# EAGLE design devkit (EAGLE 7.5.0)

## Sheet 1 of 3
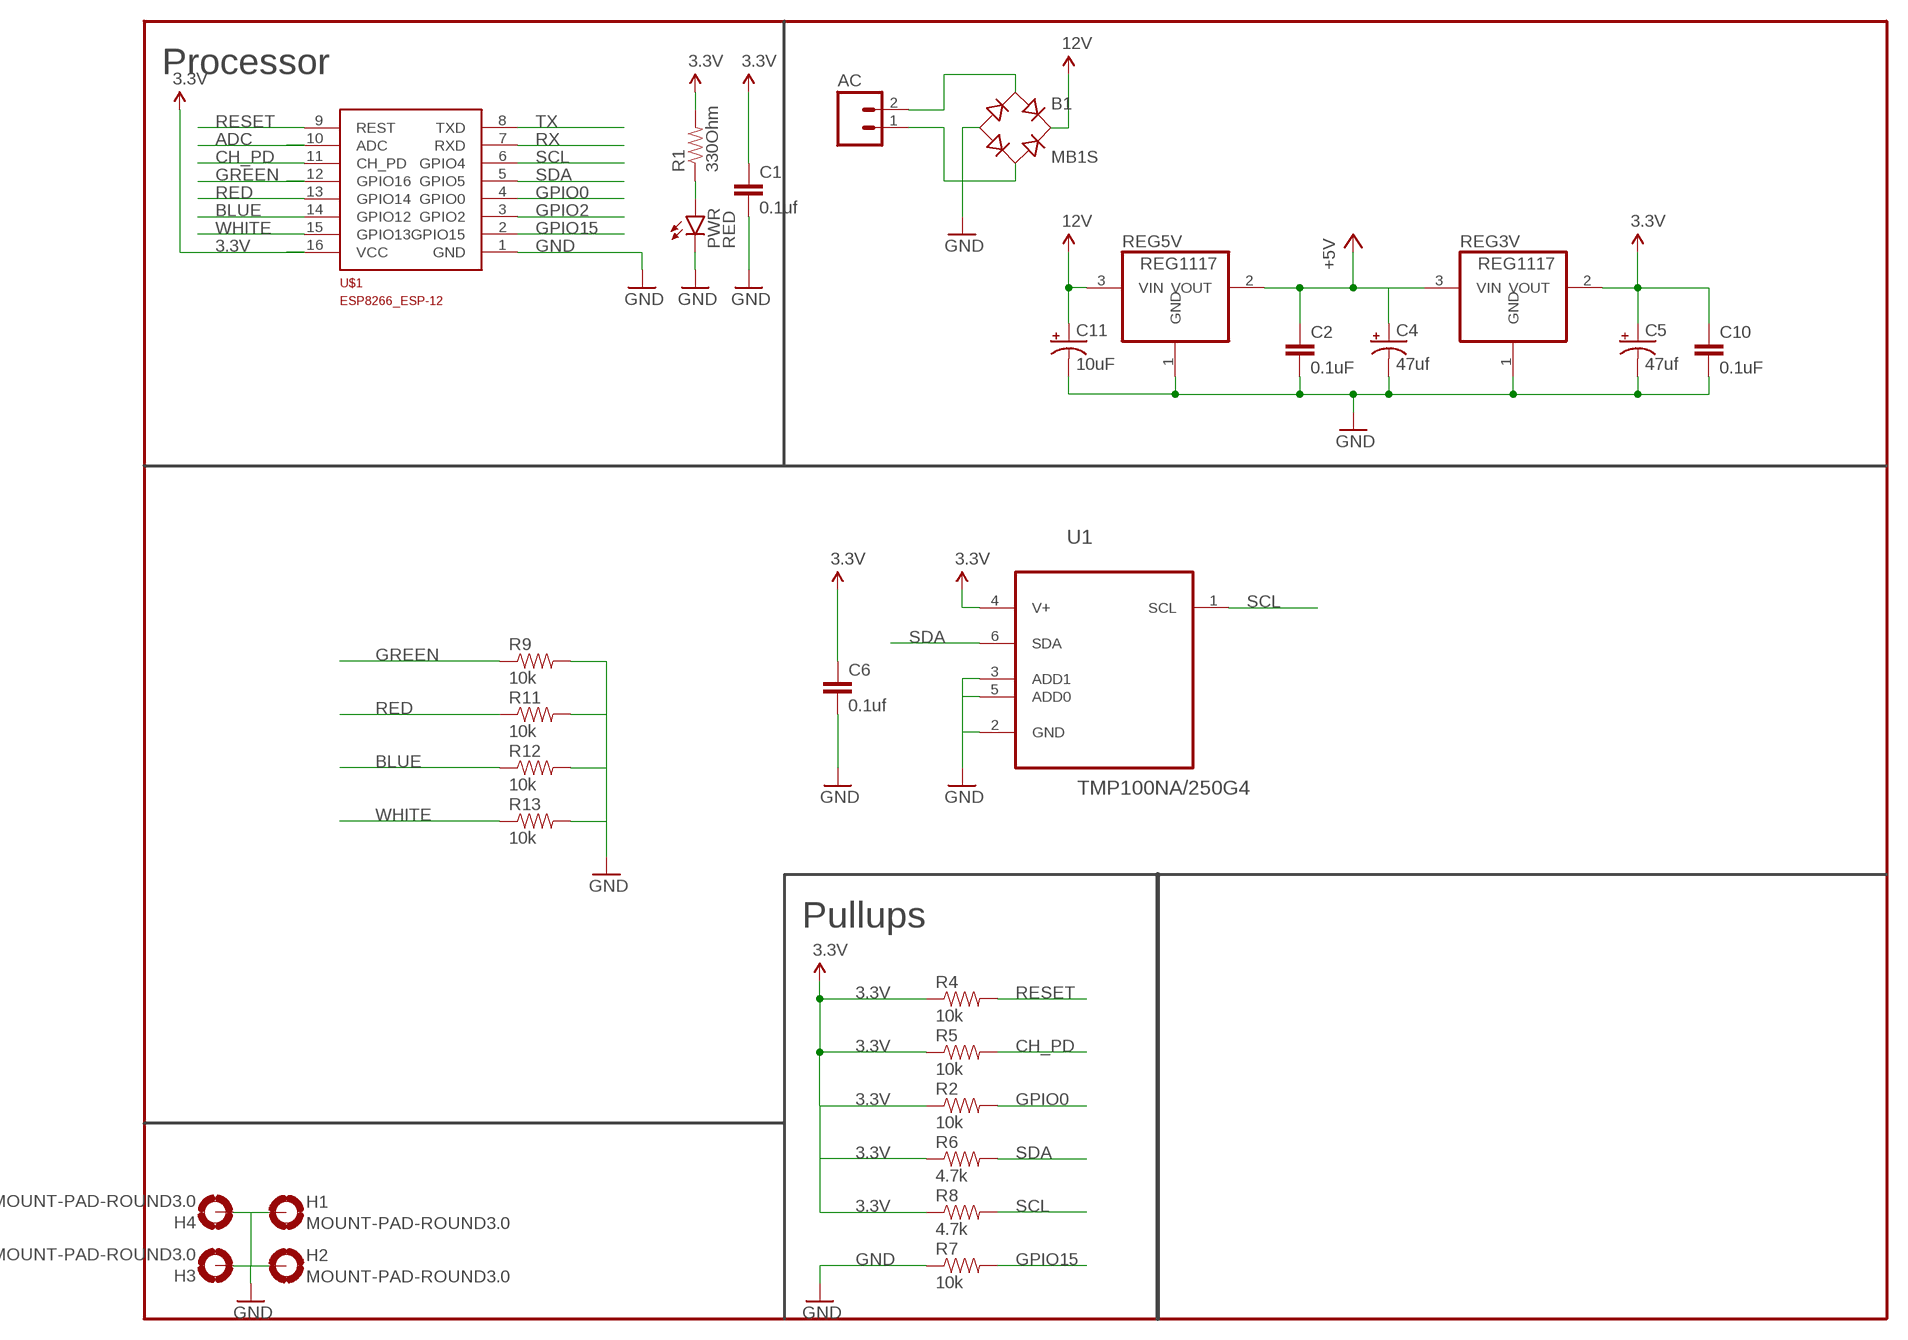
[diagram p0: schematic, sheet 1]

### Parts
AC  M02JST-PTH-VERT  [JST-2-PTH-VERT]
B1  MB1S  [SOIC-4]
C1  0.1uf  CAP0805  [0805]
C2  0.1uF  CAP0805  [0805]
C4  47uf  CAP_POLC  [PANASONIC_C]
C5  47uf  CAP_POLC  [PANASONIC_C]
C6  0.1uf  CAP0805  [0805]
C10  0.1uF  CAP0805  [0805]
C11  10uF  10UF-TANT  [EIA3216]
FRAME1  FRAME-LETTERNO_PACKAGE  [DUMMY]
H1  MOUNT-PAD-ROUND3.0  [3,0-PAD]
H2  MOUNT-PAD-ROUND3.0  [3,0-PAD]
H3  MOUNT-PAD-ROUND3.0  [3,0-PAD]
H4  MOUNT-PAD-ROUND3.0  [3,0-PAD]
PWR  RED  LED-RED1206  [LED-1206]
R1  330Ohm  RESISTOR0805-RES  [0805]
R2  10k  RESISTOR0805-RES  [0805]
R4  10k  RESISTOR0805-RES  [0805]
R5  10k  RESISTOR0805-RES  [0805]
R6  4.7k  RESISTOR0805-RES  [0805]
R7  10k  RESISTOR0805-RES  [0805]
R8  4.7k  RESISTOR0805-RES  [0805]
R9  10k  RESISTOR0805-RES  [0805]
R11  10k  RESISTOR0805-RES  [0805]
R12  10k  RESISTOR0805-RES  [0805]
R13  10k  RESISTOR0805-RES  [0805]
REG3V  REG1117  [SOT223]
REG5V  REG1117  [SOT223]
U1  TMP100NA/250G4  [SOT95P280X145-6N]
U$1  ESP8266_ESP-12  [ESP8266-ESP12]

### Nets
3.3V: C1.1 C5.+ C6.1 C10.1 R1.2 R2.1 R4.1 R5.1 R6.1 R8.1 REG3V.2(VOUT) U1.4(V+) U$1.16(VCC) ; also sheet 2
12V: B1.+ C11.A(+) REG5V.3(VIN) ; also sheet 3
+5V: C2.1 C4.+ REG3V.3(VIN) REG5V.2(VOUT) ; also sheet 2
ADC: U$1.10(ADC)
BLUE: R12.1 U$1.14(GPIO12) ; also sheet 3
CH_PD: R5.2 U$1.11(CH_PD)
GND: B1.- C1.2 C2.2 C4.- C5.- C6.2 C10.2 C11.C(-) H1.B3,0(MOUNT) H2.B3,0(MOUNT) H3.B3,0(MOUNT) H4.B3,0(MOUNT) PWR.C R7.1 R9.2 R11.2 R12.2 R13.2 REG3V.1(GND) REG5V.1(GND) U1.2(GND) U1.3(ADD1) U1.5(ADD0) U$1.1(GND) ; also sheet 2,3
GPIO0: R2.2 U$1.4(GPIO0) ; also sheet 2
GPIO2: U$1.3(GPIO2)
GPIO15: R7.2 U$1.2(GPIO15)
GREEN: R9.1 U$1.12(GPIO16) ; also sheet 3
N$2: PWR.A R1.1
N$3: AC.2 B1.~1(AC1)
N$4: AC.1 B1.~2(AC2)
RED: R11.1 U$1.13(GPIO14) ; also sheet 3
RESET: R4.2 U$1.9(REST) ; also sheet 2
RX: U$1.7(RXD) ; also sheet 2
SCL: R8.2 U1.1(SCL) U$1.6(GPIO4)
SDA: R6.2 U1.6(SDA) U$1.5(GPIO5)
TX: U$1.8(TXD) ; also sheet 2
WHITE: R13.1 U$1.15(GPIO13) ; also sheet 3

### Notes on the sheet
- Processor
- Pullups

## Sheet 2 of 3
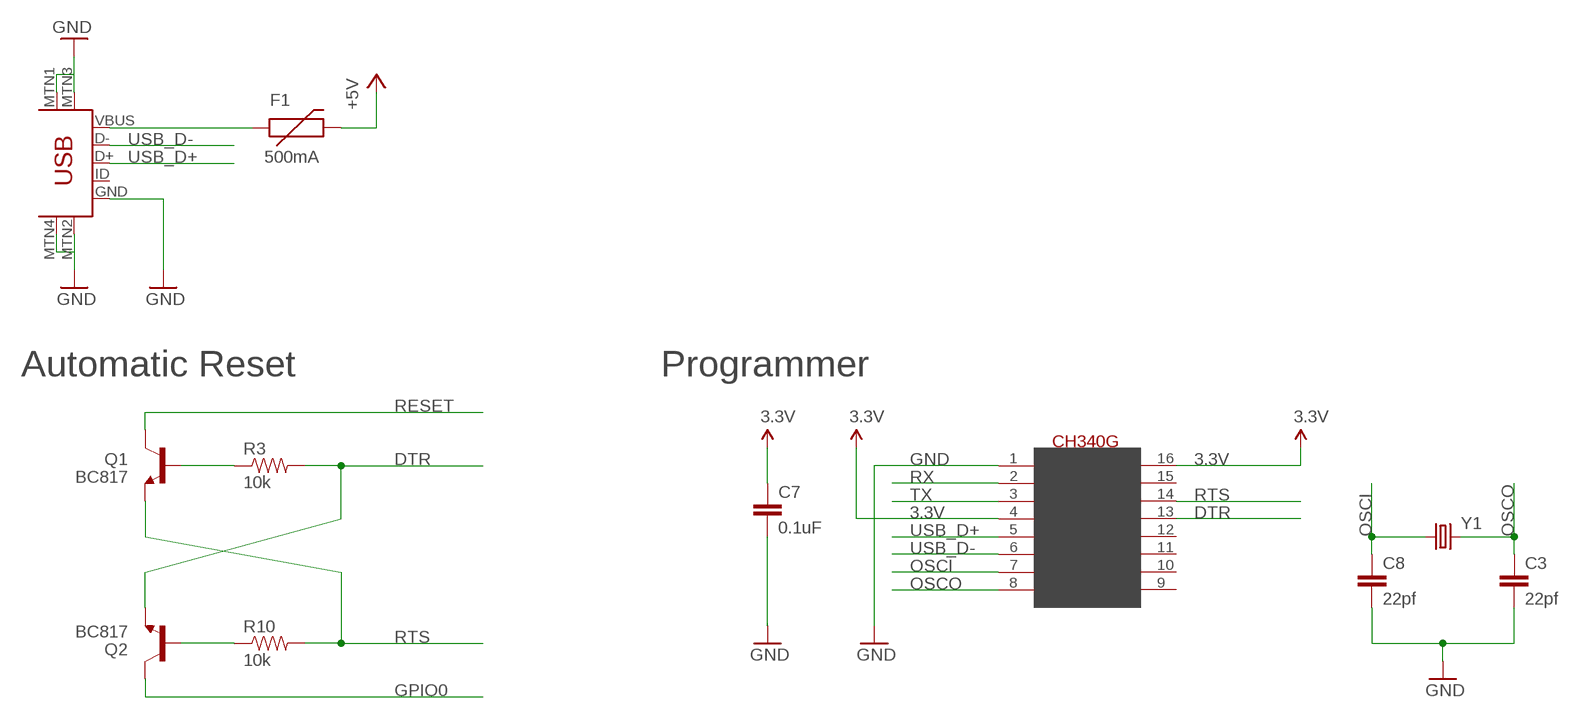
[diagram p1: schematic, sheet 2]

### Parts
C3  22pf  CAP0805  [0805]
C7  0.1uF  CAP0805  [0805]
C8  22pf  CAP0805  [0805]
F1  500mA  PTCSMD-W  [PTC-1206-WIDE]
Q1  BC817  TRANSISTOR_NPNSOT23-3  [SOT23-3]
Q2  BC817  TRANSISTOR_NPNSOT23-3  [SOT23-3]
R3  10k  RESISTOR0805-RES  [0805]
R10  10k  RESISTOR0805-RES  [0805]
U$2  CH340G  [SOIC16]
U$3  USB-MINIB-5PIN  [USB-MINIB]
Y1  CRYSTALSMD  [HC49UP]

### Nets
3.3V: C7.1 U$2.4(V3) U$2.16(VCC) ; also sheet 1
+5V: F1.2 ; also sheet 1
DTR: Q2.2(E) R3.2 U$2.13(DTR)
GND: C3.2 C7.2 C8.2 U$2.1(GND) U$3.GND U$3.MTN1(MTN2) U$3.MTN2(MTN3) U$3.MTN3(MTN1) U$3.MTN4 ; also sheet 1,3
GPIO0: Q2.3(C) ; also sheet 1
N$1: Q1.1(B) R3.1
N$5: Q2.1(B) R10.1
N$6: F1.1 U$3.VBUS
OSCI: C8.1 U$2.7(XI) Y1.1
OSCO: C3.1 U$2.8(XO) Y1.2
RESET: Q1.3(C) ; also sheet 1
RTS: Q1.2(E) R10.2 U$2.14(RTS)
RX: U$2.2(TX) ; also sheet 1
TX: U$2.3(RX) ; also sheet 1
USB_D+: U$2.5(D+) U$3.D+
USB_D-: U$2.6(D-) U$3.D-
Unconnected: U$2.9(CTS) U$2.10(DSR) U$2.11(RI) U$2.12(DCD) U$2.15(RS232) U$3.ID

### Notes on the sheet
- Automatic Reset | Programmer

## Sheet 3 of 3
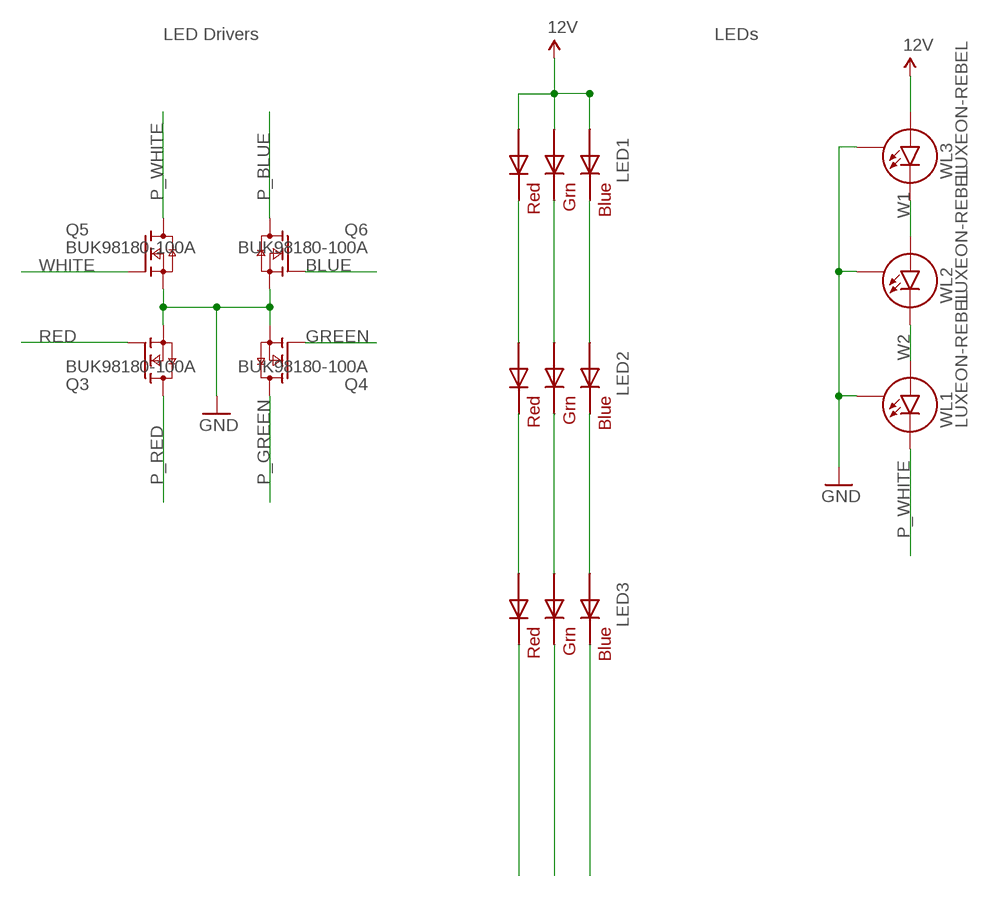
[diagram p2: schematic, sheet 3]

### Parts
LED1  RGBLED5050  [RGBLED5050]
LED2  RGBLED5050  [RGBLED5050]
LED3  RGBLED5050  [RGBLED5050]
Q3  BUK98180-100A  [SOT223]
Q4  BUK98180-100A  [SOT223]
Q5  BUK98180-100A  [SOT223]
Q6  BUK98180-100A  [SOT223]
WL1  LUXEON-REBEL  [LUXEON-REBEL]
WL2  LUXEON-REBEL  [LUXEON-REBEL]
WL3  LUXEON-REBEL  [LUXEON-REBEL]

### Nets
12V: LED1.1(GREEN_A) LED1.2(RED_A) LED1.3(BLUE_A) WL3.ANODE(A) ; also sheet 1
BLUE: Q6.1(G) ; also sheet 1
GND: Q3.3(S) Q4.3(S) Q5.3(S) Q6.3(S) WL1.P$3(S) WL2.P$3(S) WL3.P$3(S) ; also sheet 1,2
GREEN: Q4.1(G) ; also sheet 1
N$7: LED1.6(GREEN_C) LED2.1(GREEN_A)
N$8: LED1.4(BLUE_C) LED2.3(BLUE_A)
N$9: LED1.5(RED_C) LED2.2(RED_A)
N$10: LED2.6(GREEN_C) LED3.1(GREEN_A)
N$11: LED2.4(BLUE_C) LED3.3(BLUE_A)
N$12: LED2.5(RED_C) LED3.2(RED_A)
P_BLUE: LED3.4(BLUE_C) Q6.2(D) Q6.4(D)
P_GREEN: LED3.6(GREEN_C) Q4.2(D) Q4.4(D)
P_RED: LED3.5(RED_C) Q3.2(D) Q3.4(D)
P_WHITE: Q5.2(D) Q5.4(D) WL1.CATHODE(C)
RED: Q3.1(G) ; also sheet 1
W1: WL2.ANODE(A) WL3.CATHODE(C)
W2: WL1.ANODE(A) WL2.CATHODE(C)
WHITE: Q5.1(G) ; also sheet 1

### Notes on the sheet
- LED Drivers | LEDs

## Library data of the parts
AC = SparkFun-Connectors:M02: Standard 2-pin 0.1" header. Use with - straight break away headers ( PRT-00116) - right angle break away headers (PRT-00553) - swiss pins (PRT-00743) - machine pins (PRT-00117) - female headers (PRT-00115) Molex polarized connector foot print use with: PRT-08233 with associated crimp pins and housings. 2.54_SCREWTERM for use with PRT-10571. 3.5mm Screw Terminal footprints for PRT-08084 5mm Screw Terminal footprints for use with PRT-08432
B1 = rectifier:MB*S: Bridge Rectifier Source: http://www.fairchildsemi.com/ds/MB/MB6S.pdf
C1-C3 C6-C8 C10 = SparkFun-Capacitors:CAP: Capacitor Standard 0603 ceramic capacitor, and 0.1" leaded capacitor.
C4 C5 = SparkFun-Capacitors:CAP_POL: Capacitor Polarized These are standard SMD and PTH capacitors. Normally 10uF, 47uF, and 100uF in electrolytic and tantalum varieties. Always verify the external diameter of the through hole cap, it varies with capacity, voltage, and manufacturer. The EIA devices should be standard.
C11 = SparkFun-Retired:10UF-TANT: 10uF Tantalum SMT CAP-00811- 16V 10% (EIA-3216); PROD_ID: CAP-00811
F1 = SparkFun-PowerIC:PTC: Resettable Fuse PTC Resettable Fuse. Spark Fun Electronics SKU : COM-08357
FRAME1 = SparkFun-Aesthetics:FRAME-LETTER: Schematic Frame Standard 8.5x11 US Letter frame; DESIGNER: Nobody; VERSION: v01
H1-H4 = holes:MOUNT-PAD-ROUND: MOUNTING PAD, round
LED1-LED3 = adafruit:RGBLED: For 5050 RGB LEDs, the order of the LEDs may vary from one manufacturer to another!
PWR = SparkFun-LED:LED-RED: Assorted Red LEDs LilyPad 1206- DIO-09912 1206- DIO-00809 0603- DIO-00819; PROD_ID: DIO-00809
Q1 Q2 = SparkFun-DiscreteSemi:TRANSISTOR_NPN: Generic NPN BJT MMBT2222A - TRANS-08049 (SOT-23, 1A 40V) MPSA42 - TRANS-09116 (SOT-23, 500mA 300V) MMBT5088LT1G - TRANS-11160 (SOT-23, 50 mA 30V) BC547 - COM-08928 <http://www.sparkfun.com/products/8928> (TO-92 45V 100mA) (1.Collector 2.Base 3.Emitter) 2N3904 - COM-00521 <http://www.sparkfun.com/products/521> (TO-92 40V 200mA) (1.Emitter 2.Base 3.Collector) P2N2222A - COM-12852 <http://www.sparkfun.com/products/12852> (TO-92 40V 600mA) (1.Collector 2.Base 3.Emitter); PROD_ID: TRANS-08049
Q3-Q6 = nxp_60:BUK98180-100A: N-channel TrenchMOS logic level FET Logic level N-channel enhancement mode Field-Effect Transistor (FET) in a plastic package using TrenchMOS technology. This product has been designed and qualified to the appropriate AEC standard for use in automotive critical applications. AAL Eindhoven MK
R1-R13 = SparkFun-Resistors:RESISTOR: Resistor Basic schematic elements and footprints for 0603, 1206, and PTH resistors.
REG3V REG5V = burr-brown:REG1117: 800mA and 1A Low Dropout (LDO) Positive Regulator 1.8V, 2.5V, 2.85V, 3.3V, 5V, and Adj; MPN: REG1117; OC_FARNELL: 1097566; OC_NEWARK: 14P6981
U1 = Texas Instruments_By_element14_Batch_1:TMP100NA/250G4: Digital Temperature Sensor with I2C Interface; MPN: TMP100NA/250G4; OC_FARNELL: 1234659; OC_NEWARK: 13M3229; PACKAGE: SOT-23-6; SUPPLIER: Texas Instruments
U$1 = ESP8266-ESP12:ESP8266_ESP-12
U$2 = CH340G-USB-SERIAL:CH340G
U$3 = SparkFun-Connectors:USB-MINIB: Mini-USB "B" connector with 5th pin broken out. Created new symbol breaking out 5th "ID" pin in mini/micro USB connector spec. See: http://en.wikipedia.org/wiki/Mini_usb#Cables. Uses same footprint as 4-pin symbol. Also added pins to connect to mounting / shield pads if required (probably not generally needed as signals aren't shielded once they leave the connector).
WL1-WL3 = SparkFun-LED:LUXEON-REBEL: Luxeon Rebel single-color high output LED
Y1 = SparkFun-FreqCtrl:CRYSTAL: Various standard crystals. Proven footprints.

## Board
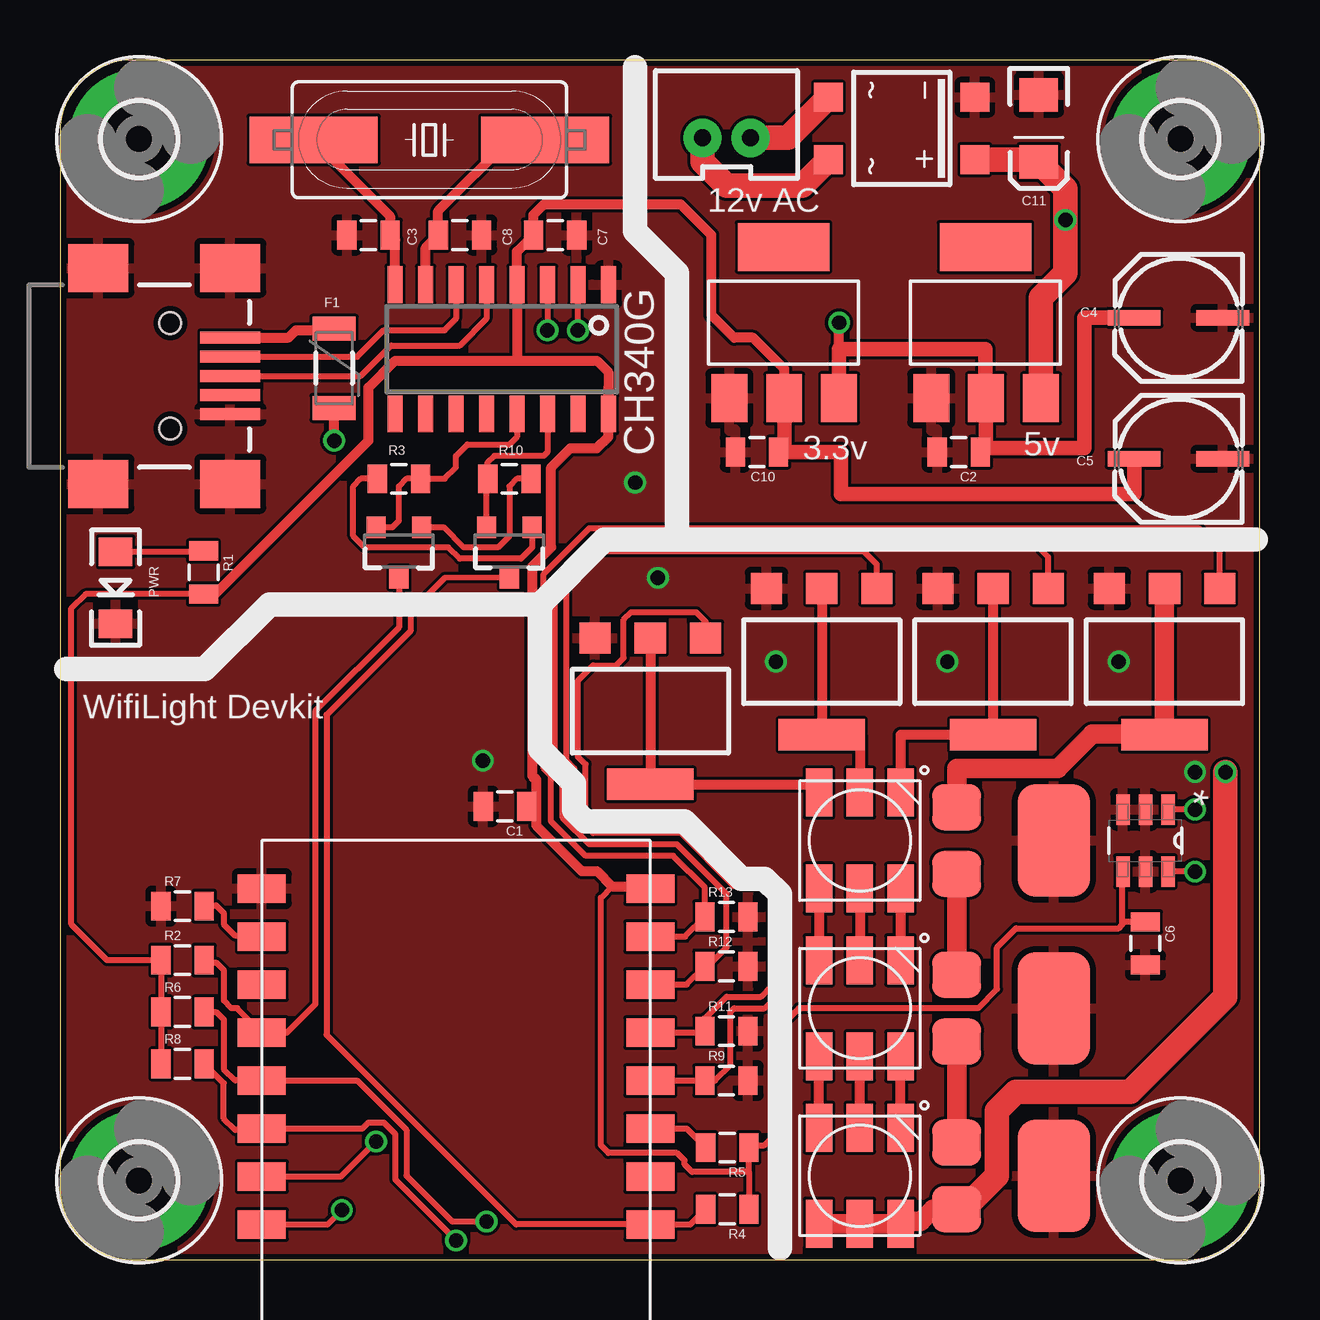
[diagram p3: board, top side]
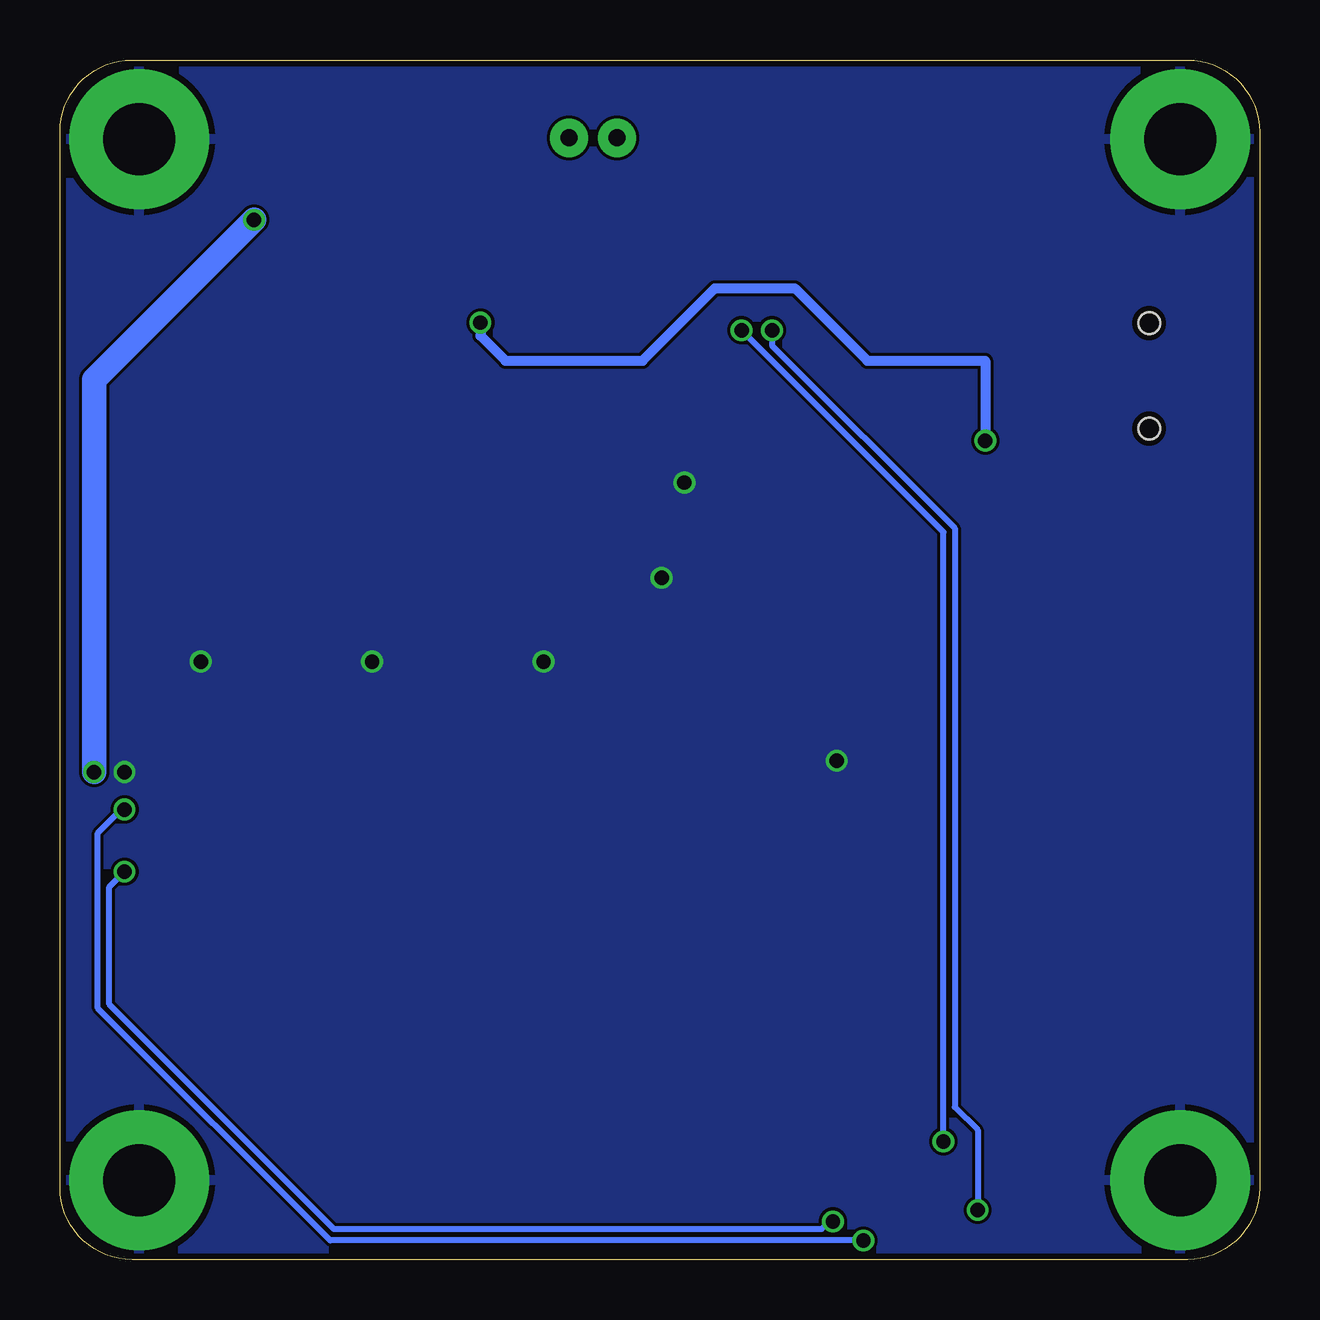
[diagram p4: board, bottom side, seen from below]

Size 50 x 50 mm. Coordinates in mm from the lower left corner, seen from the top.
Outline: 0,47 0,3 arc90 3,0 47,0 arc90 50,3 50,47 arc90 47,50 3,50 arc90 0,47
Copper layers (1*16): Top 0.035mm / dielectric 1.5mm / Bottom 0.035mm
Design rules "dirtypcbs": minimum track width 5mil, minimum drill 12mil, track to track 5mil, track to pad 5mil, pad to pad 5mil, via to via 5mil, smd to smd 0mil, copper to edge 10mil, drill to drill 10mil, minimum pad ring 10mil, minimum via ring 6mil, stop-mask expansion 2mil, vias tented up to drill 25mil, thermal gap 10mil

### Footprints (pad centres in the part's own frame; a part is rotated, then mirrored left to right if it is on the bottom)
JST-2-PTH-VERT = drill 0.7 pad 1.6: 1 -1,-0.55; 2 1,-0.55
SOIC-4 = smd 1.2 x 1.2: + 1.3,3.05; - -1.3,3.05; ~1 -1.3,-3.05; ~2 1.3,-3.05
0805 = smd 0.8 x 1.2: 1 -0.9,0; 2 0.9,0
PANASONIC_C = smd 2.2 x 0.65: + 1.9,-0.2; - -1.8,-0.2
EIA3216 = smd 1.4 x 1.6: A 1.4,0; C -1.4,0
PTC-1206-WIDE = smd 1 x 1.8: 1 -1.654,0; 2 1.654,0
3,0-PAD = drill 3 pad 5.842: B3,0 0,0
RGBLED5050 = smd 2 x 1.1: 1 -2,1.7; 2 -2,0; 3 -2,-1.7; 4 2,-1.7; 5 2,0; 6 2,1.7
LED-1206 = smd 1.2 x 1.4: A -1.5,0; C 1.5,0
SOT23-3 = smd 0.8 x 0.9: 1 -0.95,-1; 2 0.95,-1; 3 0,1.1
SOT223 = smd 1.3 x 1.3: 1 -2.3,-3.05; 2 0,-3.05; 3 2.3,-3.05 | smd 3.6 x 1.3: 4 0,3.05
SOT223' = smd 1.499 x 2.007: 1 -2.261,-3.15; 2 0.025,-3.15; 3 2.311,-3.15 | smd 3.81 x 2.007: 4 0,3.15
SOT95P280X145-6N = smd 1.27 x 0.559: 1 -1.295,0.94; 2 -1.295,0; 3 -1.295,-0.94; 4 1.295,-0.94; 5 1.295,0; 6 1.295,0.94
ESP8266-ESP12 = smd 2 x 1.2: 1 16.2,2; 2 16.2,4; 3 16.2,6; 4 16.2,8; 5 16.2,10; 6 16.2,12; 7 16.2,14; 8 16.2,16; 9 0,16; 10 0,14; 11 0,12; 12 0,10; 13 0,8; 14 0,6; 15 0,4; 16 0,2
SOIC16 = smd 0.635 x 1.524: 1 -4.445,-2.695; 2 -3.175,-2.695; 3 -1.905,-2.695; 4 -0.635,-2.695; 5 0.635,-2.695; 6 1.905,-2.695; 7 3.175,-2.695; 8 4.445,-2.695; 9 4.445,2.695; 10 3.175,2.695; 11 1.905,2.695; 12 0.635,2.695; 13 -0.635,2.695; 14 -1.905,2.695; 15 -3.175,2.695; 16 -4.445,2.695
USB-MINIB = smd 2.5 x 0.5: D+ 2.5,0; D- 2.5,0.8; GND 2.5,-1.6; ID 2.5,-0.8; VBUS 2.5,1.6 | smd 2.5 x 2: MTN1 -3,4.5; MTN2 2.5,4.5; MTN3 -3,-4.5; MTN4 2.5,-4.5 | hole 0.9: 0,2.2; 0,-2.2
LUXEON-REBEL = smd 1.91 x 2.03: ANODE -1.39,2.63; CATHODE 1.39,2.63 | smd 4.68 x 3.03: P$3 0,-1.42
HC49UP = smd 5.334 x 1.93: 1 -4.826,0; 2 4.826,0

### Placement (x,y rotation side)
AC  27.78,47.31 0 top
B1  35.08,47.15 270 top
C1  18.54,18.89 180 top
C2  37.47,33.66 180 top
C3  12.86,42.7 180 top
C4  46.67,39.05 180 top
C5  46.67,33.18 180 top
C6  45.24,13.18 270 top
C7  20.64,42.7 0 top
C8  16.67,42.7 0 top
C10  29.05,33.66 180 top
C11  40.8,47.15 270 top
F1  11.43,37.15 270 top
FRAME1  0.16,0.16 0 top
H1  46.7,3.3 0 top
H2  3.3,46.7 0 top
H3  46.7,46.7 0 top
H4  3.3,3.3 0 top
LED1  33.34,3.49 90 top
LED2  33.34,10.48 90 top
LED3  33.34,17.46 90 top
PWR  2.32,28 270 top
Q1  18.73,29.53 180 top
Q2  14.13,29.53 180 top
Q3  31.75,24.92 180 top
Q4  24.61,22.86 180 top
Q5  46.04,24.92 180 top
Q6  38.89,24.92 180 top
R1  5.98,28.64 270 top
R2  5.11,12.48 0 top
R3  14.13,32.54 0 top
R4  27.81,2.1 180 top
R5  27.81,4.67 180 top
R6  5.11,10.32 0 top
R7  5.11,14.73 0 top
R8  5.11,8.16 0 top
R9  27.78,7.46 0 top
R10  18.73,32.54 180 top
R11  27.78,9.53 0 top
R12  27.78,12.22 0 top
R13  27.78,14.29 0 top
REG3V  REG1117  [SOT223']  30.16,39.05 0 top
REG5V  REG1117  [SOT223']  38.58,39.05 0 top
U1  45.24,17.46 270 top
U$1  24.61,17.46 180 top
U$2  18.41,37.94 180 top
U$3  4.6,36.83 0 top
WL1  40.01,17.46 90 top
WL2  40.01,10.48 90 top
WL3  40.01,3.49 90 top
Y1  15.4,46.67 180 top

### Tracks (layer width: path | path; a pad name or v marks a point on that pad's centre or on a via)
3.3V
  Top 0.254: R8.1 R6.1 R2.1 1.97,12.48 0.48,13.97 0.48,27.15 1.07,27.74 R1.2 | 28.71,3.65 26.35,3.65 26.04,3.97 26.04,4.13 25.72,4.45 22.86,4.45 22.54,4.76 22.54,15.08 23.02,15.56 | 24.51,15.56 U$1.16 | 28.71,3.65 R5.1 28.81,4.76 29.37,4.76 30,5.4 30,9.68 30.8,10.48 38.26,10.48 39.05,11.27 39.05,13.02 39.85,13.81 44.13,13.81 44.29,13.97 44.29,14.13 | 28.71,3.65 R4.1 | U1.4 44.29,16.15 44.29,14.13 | C6.1 44.34,14.08 44.29,14.13
  Top 0.406: U$2.16 22.86,36.99 22.38,37.47 19.05,37.47 | 30.2,35.89 REG3V.2 30.19,37.12 28.89,38.42 28.1,38.42 27.15,39.37 27.15,42.7 25.88,43.97 20.16,43.97 19.74,43.55 C7.1 19.05,42.02 U$2.4 19.05,37.47 | U$2.16 22.86,36.35 | R1.2 6.47,27.74 12.86,34.13 12.86,36.35 13.97,37.47 19.05,37.47 | 24.51,15.56 23.02,15.56 22.38,16.19 21.75,16.19 19.84,18.1 19.84,18.89 | 19.84,18.89 19.84,20 19.68,20.16 19.68,28.89 20.48,29.69 20.48,33.02 21.27,33.81 22.38,33.81 22.86,34.29 U$2.16 | C1.1 19.84,18.89
  Top 0.61: 30.2,35.89 30.2,33.66 C10.1 32.54,33.66 32.54,31.91 44.77,31.91 C5.+
12V  (via drill 0.6)
  Top 0.813: LED1.1 LED1.2 LED1.3 35.13,1.59 35.88,1.59 36.39,2.1 WL3.ANODE
  Top 1.016: B1.+ 40.7,45.85 C11.A 41.91,44.64 v41.91,43.34 41.91,41.12 40.89,40.09 REG5V.3 | WL3.ANODE 37.66,2.1 39.05,3.49 39.05,6.19 39.85,6.99 44.61,6.99 48.58,10.95 v48.58,20.32
  Bottom 1.016: v48.58,20.32 48.58,36.67 v41.91,43.34
+5V  (via drill 0.6)
  Top 0.406: REG3V.3 v32.47,39.05 | v11.43,34.13 F1.2
  Top 0.61: REG3V.3 32.47,37.94 38.58,37.94 38.58,35.9 REG5V.2 38.6,33.81 | C2.1 38.37,33.81 38.6,33.81 | 38.6,33.81 42.7,33.81 42.7,39.25 C4.+
  Bottom 0.406: v32.47,39.05 32.47,38.51 31.43,37.47 25.72,37.47 22.7,40.48 19.37,40.48 16.35,37.47 11.43,37.47 v11.43,34.13
BLUE
  Top 0.254: Q6.1 41.19,29.29 40.48,30 22.23,30 20.64,28.42 20.64,20.64 20.95,20.32 20.95,18.41 22.07,17.3 25.72,17.3 27.78,15.24 27.78,13.02 26.99,12.22 R12.1 26.12,11.46 U$1.14
CH_PD
  Top 0.254: U$1.11 26.12,5.46 R5.2
DTR
  Top 0.254: Q2.2 13.86,30.53 14.13,30.8 14.13,32.23 14.45,32.54 R3.2 16.03,32.54 16.51,33.02 16.51,33.5 16.99,33.97 18.73,33.97 19.05,34.29 U$2.13
GND  (via drill 0.6)
  other vias: 23.97,32.38 29.84,24.92 24.92,28.42 36.99,24.92 44.13,24.92 17.62,20.8 47.31,20.32
  pour Bottom: 0,50 50,50 50,0 0,0
  pour Top: 50,50 0,50 0,0 50,0
GPIO0
  Top 0.254: R2.2 6.11,12.38 6.51,12.38 6.83,12.06 6.83,10.79 7.14,10.48 7.39,10.48 U$1.4 9.46,9.46 10.64,10.64 10.64,22.86 14.13,26.35 Q2.3
GPIO15
  Top 0.254: U$1.2 8.38,13.49 7.3,13.49 6.83,13.97 6.83,14.45 6.51,14.76 6.04,14.76 R7.2
GREEN
  Top 0.254: Q4.1 26.91,26.59 26.51,26.99 23.81,26.99 23.5,26.67 23.5,25.08 23.18,24.77 22.23,24.77 21.59,24.13 21.59,20.95 21.91,20.64 21.91,18.73 22.38,18.26 26.04,18.26 28.26,16.03 29.37,16.03 30.16,15.24 30.16,11.27 29.37,10.48 28.1,10.48 27.94,10.32 27.94,8.1 27.3,7.46 R9.1 U$1.12
N$1
  Top 0.254: Q1.1 19.68,29.68 19.21,29.21 16.67,29.21 16.19,29.69 12.7,29.69 12.22,30.16 12.22,32.23 12.54,32.54 R3.1
N$2
  Top 0.254: PWR.A 5.95,29.5 R1.1
N$3
  Top 1.016: AC.2 30.34,46.76 B1.~1
N$4
  Top 1.016: AC.1 26.78,45.77 27.78,44.77 30.95,44.77 B1.~2
N$5
  Top 0.254: R10.1 19.05,32.54 18.73,32.23 18.73,30.16 18.26,29.69 16.83,29.69 15.99,30.53 Q2.1
N$6
  Top 0.406: U$3.VBUS 9.54,38.43 9.84,38.73 11.36,38.73 F1.1
N$7
  Top 0.406: LED1.6 LED2.1
N$8
  Top 0.406: LED1.4 LED2.3
N$9
  Top 0.406: LED1.5 LED2.2
N$10
  Top 0.406: LED3.1 LED2.6
N$11
  Top 0.406: LED3.3 LED2.4
N$12
  Top 0.406: LED3.2 LED2.5
OSCI
  Top 0.406: Y1.1 18.73,46.67 15.77,43.71 C8.1 15.24,42.17 U$2.7
OSCO
  Top 0.406: Y1.2 13.76,43.49 C3.1 13.97,42.49 U$2.8
P_BLUE
  Top 0.406: LED3.4 35.04,21.87 Q6.4 Q6.2
P_GREEN
  Top 0.406: LED3.6 31.64,19.81 Q4.4 Q4.2
P_RED
  Top 0.406: LED3.5 33.34,21.87 Q3.4 Q3.2
P_WHITE
  Top 0.813: WL1.CATHODE 37.38,20.48 41.59,20.48 43.02,21.91 46.04,21.91 | Q5.2 46.04,21.91 | 46.04,21.91 Q5.4
RED
  Top 0.254: Q3.1 34.05,28.97 33.5,29.53 22.38,29.53 21.11,28.26 21.11,20.8 21.43,20.48 21.43,18.57 22.23,17.78 25.88,17.78 28.1,15.56 29.21,15.56 29.69,15.08 29.69,11.43 29.21,10.95 27.78,10.95 26.88,10.05 R11.1 26.82,9.46 U$1.13
RESET
  Top 0.254: Q1.3 16.03,28.42 14.61,26.99 14.61,26.19 11.11,22.7 11.11,9.37 19.02,1.46 U$1.9 26.28,1.46 R4.2
RTS
  Top 0.254: Q1.2 17.78,32.49 R10.2 17.83,33.23 18.1,33.5 20.16,33.5 20.32,33.66 U$2.14
RX  (via drill 0.6)
  Top 0.254: U$1.7 11.72,3.46 v13.18,4.92 | v21.59,38.73 U$2.2
  Bottom 0.254: v13.18,4.92 13.18,30.32 v21.59,38.73
SCL  (via drill 0.6)
  Top 0.254: R8.2 6.83,7.34 6.83,5.87 7.3,5.4 8.34,5.4 U$1.6 12.61,5.46 12.86,5.71 13.49,5.71 13.97,5.24 13.97,3.33 v16.51,0.79 | v47.31,18.76 U1.1
  Bottom 0.254: v16.51,0.79 38.73,0.79 48.42,10.48 48.42,17.78 47.47,18.73 v47.31,18.76
SDA  (via drill 0.6)
  Top 0.254: R6.2 6.51,10.32 6.83,10 6.83,7.94 7.3,7.46 U$1.5 12.38,7.46 14.45,5.4 14.45,3.49 16.35,1.59 v17.78,1.59 | v47.31,16.17 U1.6
  Bottom 0.254: v17.78,1.59 17.94,1.59 18.26,1.27 38.58,1.27 47.94,10.64 47.94,15.53 v47.31,16.17
TX  (via drill 0.6)
  Top 0.254: U$2.3 v20.32,38.73 | U$1.8 11.15,1.46 v11.75,2.06
  Bottom 0.254: v20.32,38.73 20.32,38.1 12.7,30.48 12.7,6.35 11.75,5.4 v11.75,2.06
USB_D+
  Top 0.254: U$3.D+ 12.54,36.83 13.81,38.1 16.67,38.1 17.78,39.21 U$2.5
USB_D-
  Top 0.254: U$3.D- 12.39,37.63 13.49,38.73 16.03,38.73 16.51,39.21 U$2.6
W1
  Top 0.813: WL3.CATHODE WL2.ANODE
W2
  Top 0.813: WL1.ANODE WL2.CATHODE
WHITE
  Top 0.254: Q5.1 48.34,29.61 47.47,30.48 22.07,30.48 20.16,28.57 20.16,20.48 20.48,20.16 20.48,18.26 21.91,16.83 25.56,16.83 26.88,15.51 R13.1 26.06,13.46 U$1.15

### Text on the board
tNames: 12v AC | 3.3v | 5v | WifiLight Devkit